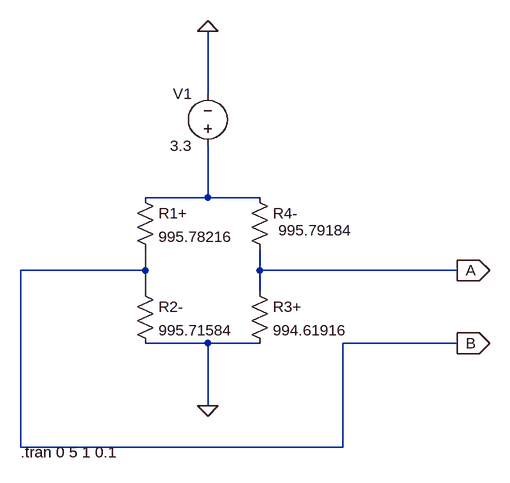
[diagram p0: schematic wheatstone_APP3_EFFORT.asc]
wheatstone_APP3_EFFORT.asc, the LTspice schematic file:
Version 4
SHEET 1 880 680
WIRE 208 -80 208 -176
WIRE 208 80 208 0
WIRE 208 80 112 80
WIRE 288 80 208 80
WIRE 112 192 112 160
WIRE 112 192 -80 192
WIRE 288 192 288 160
WIRE 592 192 288 192
WIRE 112 224 112 192
WIRE 288 224 288 192
WIRE 208 304 112 304
WIRE 288 304 208 304
WIRE 592 304 416 304
WIRE 208 400 208 304
WIRE -80 464 -80 192
WIRE 416 464 416 304
WIRE 416 464 -80 464
FLAG 208 -176 0
FLAG 208 400 0
FLAG 592 192 A
IOPIN 592 192 Out
FLAG 592 304 B
IOPIN 592 304 Out
SYMBOL res 96 64 R0
SYMATTR InstName R1+
SYMATTR Value 995.78216
SYMBOL res 96 208 R0
SYMATTR InstName R2-
SYMATTR Value 995.71584
SYMBOL res 272 208 R0
SYMATTR InstName R3+
SYMATTR Value 994.61916
SYMBOL res 272 64 R0
WINDOW 3 45 66 Left 2
SYMATTR Value 995.79184
SYMATTR InstName R4-
SYMBOL voltage 208 16 R180
WINDOW 0 24 96 Left 2
WINDOW 3 24 16 Left 2
WINDOW 123 0 0 Left 0
WINDOW 39 0 0 Left 0
SYMATTR InstName V1
SYMATTR Value 3.3
TEXT -80 472 Left 2 !.tran 0 5 1 0.1

The netlist it stands for:
* wheatstone_APP3_EFFORT.asc
R1+ N001 B 995.78216
R2- B 0 995.71584
R3+ A 0 994.61916
R4- N001 A 995.79184
V1 N001 0 3.3
.tran 0 5 1 0.1
.backanno
.end